# Altium schematic sheet Sheet1.SchDoc
size A4; SheetNumber: 1; SheetTotal: 1
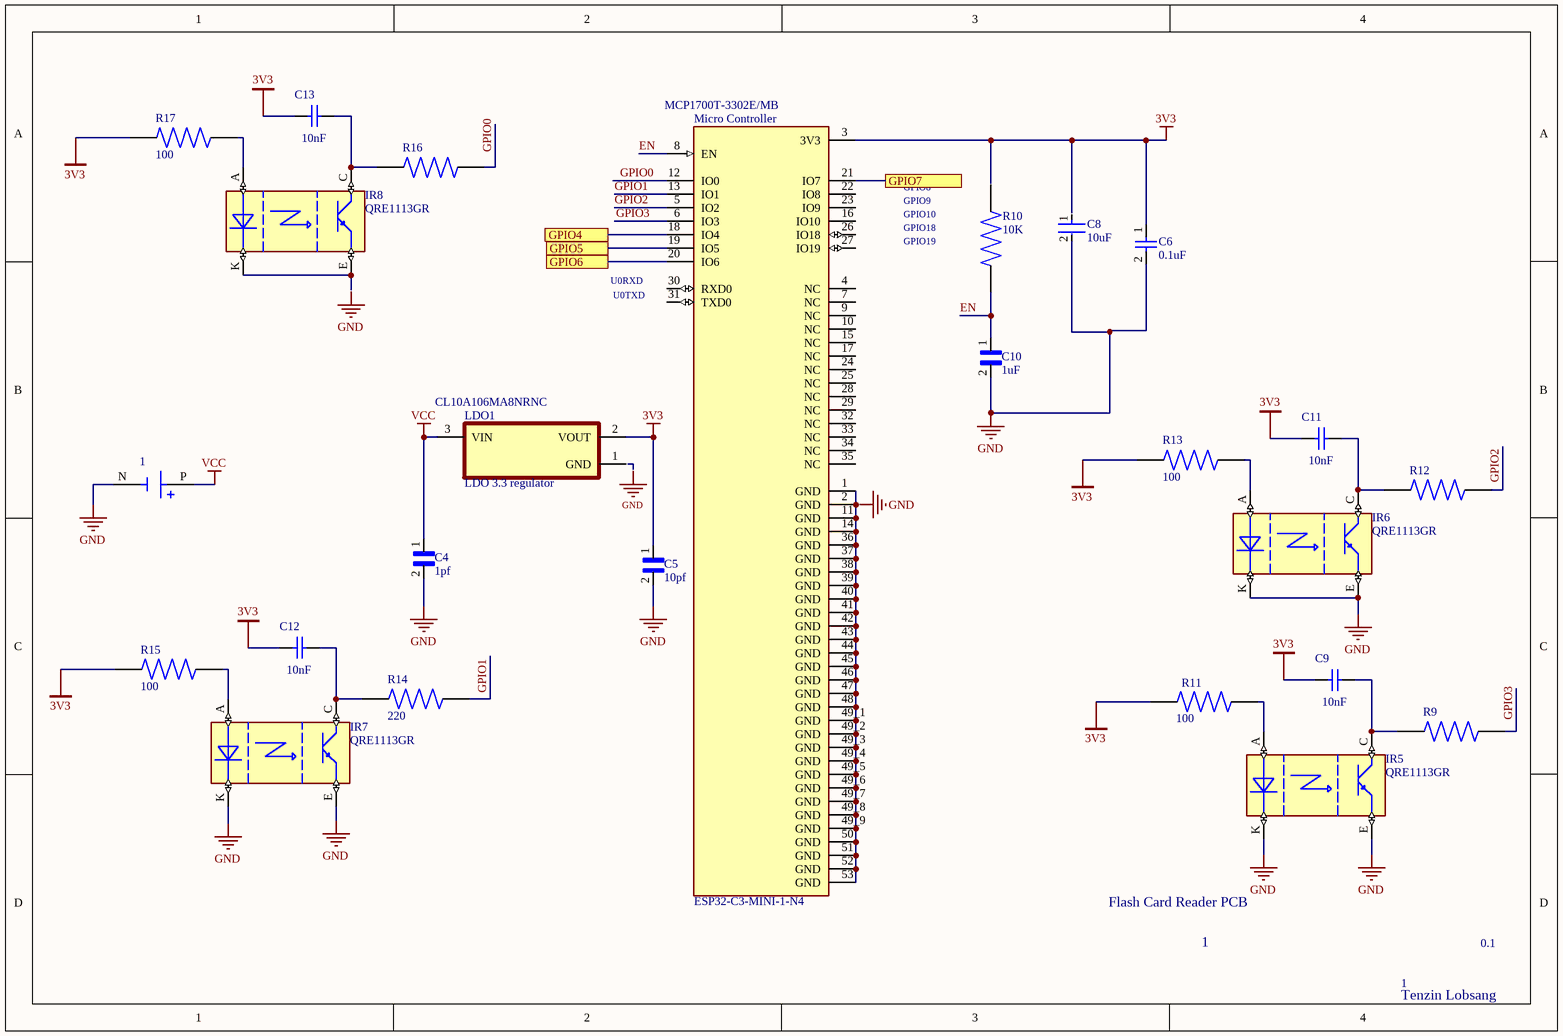
[diagram p0: Sheet1.SchDoc]

## Parts
1  (no value)  [BAT_1043]
C4  1pf  [CAPC2012X88N]
C5  10pf  [CAPC2012X88N]
C6  0.1uF  [CAPC1608X90X35NL10T15]
C8  10uF  [CAPC2012X88N]
C9  10nF  [WCAP-CSGP_0805_L2W1.25H1.25]
C10  1uF  [CAPC1608X90N]
C11  10nF  [WCAP-CSGP_0805_L2W1.25H1.25]
C12  10nF  [WCAP-CSGP_0805_L2W1.25H1.25]
C13  10nF  [WCAP-CSGP_0805_L2W1.25H1.25]
IR5  QRE1113GR  [4LEADSMD]
IR6  QRE1113GR  [4LEADSMD]
IR7  QRE1113GR  [4LEADSMD]
IR8  QRE1113GR  [4LEADSMD]
LDO1  LDO 3.3 regulator  Supplier Part Number 1: CL10A106MA8NRNC  [SOT95P237X112-3N]
Micro_Controller  ESP32-C3-MINI-1-N4  Supplier Part Number 1: MCP1700T-3302E/MB  [XCVR_ESP32-C3-MINI-1-N4]
R9  220  [RESC1005X35N]  (value not drawn)
R10  10K  [RESC1005X40N]
R11  100  [RESC6432X75N]
R12  220  [RESC1005X35N]  (value not drawn)
R13  100  [RESC6432X75N]
R14  220  [RESC1005X35N]
R15  100  [RESC6432X75N]
R16  220  [RESC1005X35N]  (value not drawn)
R17  100  [RESC6432X75N]

## Ports
GPIO4, GPIO5, GPIO6, GPIO7

## Nets
3V3: C5.1 C6.1 C9.1 C11.1 C12.1 C13.1 LDO1.2(VOUT) Micro_Controller.3(3V3) R11.1 R13.1 R15.1 R17.1
GND: 1.N(NEG) C4.2 C5.2 C6.2 C8.2 C10.2 IR5.E IR5.K IR6.E IR6.K IR7.E IR7.K
VCC: 1.P(POS) C4.1 LDO1.3(VIN)
EN: C10.1 Micro_Controller.8(EN) R10.1
GPIO0: Micro_Controller.12(IO0) R16.2
GPIO1: Micro_Controller.13(IO1) R14.2
GPIO2: Micro_Controller.5(IO2) R12.2
GPIO3: Micro_Controller.6(IO3) R9.2
GPIO4: Micro_Controller.18(IO4) ; port GPIO4
GPIO5: Micro_Controller.19(IO5) ; port GPIO5
GPIO6: Micro_Controller.20(IO6) ; port GPIO6
GPIO7: Micro_Controller.21(IO7) ; port GPIO7
NetC9_2: C9.2 IR5.C R9.1
NetC11_2: C11.2 IR6.C R12.1
NetC12_2: C12.2 IR7.C R14.1
NetC13_2: C13.2 IR8.C R16.1
NetIR5_A: IR5.A R11.2
NetIR6_A: IR6.A R13.2
NetIR7_A: IR7.A R15.2
NetIR8_A: IR8.A R17.2
NetIR8_E: IR8.E IR8.K
NetMicro_Controller_1: Micro_Controller.1(GND) Micro_Controller.2(GND) Micro_Controller.11(GND) Micro_Controller.14(GND) Micro_Controller.36(GND) Micro_Controller.37(GND) Micro_Controller.38(GND) Micro_Controller.39(GND) Micro_Controller.40(GND) Micro_Controller.41(GND) Micro_Controller.42(GND) Micro_Controller.43(GND) Micro_Controller.44(GND) Micro_Controller.45(GND) Micro_Controller.46(GND) Micro_Controller.47(GND) Micro_Controller.48(GND) Micro_Controller.49_1(GND) Micro_Controller.49_2(GND) Micro_Controller.49_3(GND) Micro_Controller.49_4(GND) Micro_Controller.49_5(GND) Micro_Controller.49_6(GND) Micro_Controller.49_7(GND) Micro_Controller.49_8(GND) Micro_Controller.49_9(GND) Micro_Controller.50(GND) Micro_Controller.51(GND) Micro_Controller.52(GND) Micro_Controller.53(GND)

Not connected (* = marked no-connect by the designer): C8 1; LDO1 1(GND); Micro_Controller 4(NC) 7(NC) 9(NC) 10(NC) 15(NC) 16(IO10) 17(NC) 22(IO8) 23(IO9) 24(NC) 25(NC) 26(IO18) 27(IO19) 28(NC) 29(NC) 30(RXD0) 31(TXD0) 32(NC) 33(NC) 34(NC) 35(NC); R10 2

## Notes on the sheet
- GPIO18
- GPIO19
- GPIO8
- GPIO9
- GPIO10
- U0RXD
- U0TXD
- Flash Card Reader PCB
- 1
- 0.1
- Tenzin Lobsang
- Labels drawn without touching a wire or pin: GND

## Library data of the parts
1 = 1043: Price: None; Availability: Unavailable; Value: *; MP: 1043; Package: None
C4 C5 = C0805C100K5RAC7800: Package: None; Price: None; Value: *; MP: C0805C100K5RAC7800; Availability: Unavailable
C6 = CMP-2100-03643-1: Chip Capacitor, 0.1 uF, +/- 10%, 50 V, -55 to 125 degC, 0603 (1608 Metric), RoHS, Tape and Reel; Manufacturer: Murata; Dielectric Material: Ceramic; Voltage Rating: 50V; Capacitance: 100nF; Dielectric: X7R; Insulation Resistance: 10GR; Case Code (Metric): 1608; Lead Free: LeadFree; Depth: 0.8mm; Number of Pins: 2; Radiation Hardening: No; Case/Package: 0603; Manufacturer URL: http://www.murata.com/; Packaging: TapeandReel; Length: 1.6mm; Contact Plating: Tin; Datasheet URL: http://psearch.en.murata.com/capacitor/product/GRM188R71H104KA93%23.pdf; Tolerance: 10%; Case Code (Imperial): 0603; Min Operating Temperature: -55degC; RoHSCompliant: true; Voltage: 50V; Termination: SMD/SMT; Mount: SurfaceMount; Material: Ceramic; Package Quantity: 1; Height: 0.8mm; Thickness: 0.035inch; REACH SVHC: NoSVHC; Max Operating Temperature: 125degC; Width: 0.8mm; Package Reference: 0603; Voltage Rating (DC): 50V; Datasheet Version: 42675.0; Package Description: 2-Pin Surface Mount Device, Body 1.6 x 0.8 mm
C8 = CMP-13271-004224-1: Cap Ceramic 10uF 25V X5R ±20% Pad SMD 0603 +85°C T/R; Width: 0.031inch; Voltage Rating: 25V; Length: 0.063inch; Case Code (Metric): 1608; Dielectric: X5R; Termination: Wraparound; Capacitance: 10uF; Lead Free: Lead Free; Mount: Surface Mount; Package Quantity: 1; Case Code (Imperial): 0603; Thickness: 0.035inch; Packaging: Tape and Reel; Contact Plating: Tin; Min Operating Temperature: -55°C; Tolerance: 20%; Max Operating Temperature: 85°C; Case/Package: 0603
C9 C11-C13 = 885012007009: WCAP-CSGP Multilayer Ceramic Chip Capacitor, General Purpose, size 0805, NP0, 10nF, 10V; Manufacturer: Wurth Elektronik; Case/Size Code: 0805; Capacitance Tolerance: +/-5%; Insulation Resistance: 10GΩ; Q Factor: 1000; Technical Reference: NP00805103J010DFCT10000; Manufacturer Part Number: 885012007009; Category: Multilayer Ceramic Chip Capacitors; Match Code: WCAP-CSGP; ComponentLink1Description: Website Link; ComponentLink1URL: https://www.we-online.com/redexpert/article/885012007009?ad; ComponentLink2Description: Datasheet Link; ComponentLink2URL: https://www.we-online.com/redexpert/spec/885012007009?ad; Mount: Surface Mount; Min Operating Temperature: -55°C; Max Operating Temperature: 125°C; Packaging: Tape and Reel; Length: 2mm; Width: 1.25mm; Height: 1.25mm; Capacitance: 10nF; Ceramic Type: NP0; Rated Voltage (DC): 10V
C10 = CL10B105KO8NNNC: 1ÂµF Â±10% 16V Ceramic Capacitor X7R 0603 (1608 Metric); MF: Samsung Electro-Mechanics; Digi-Key_Part_Number: 1276-1019-1-ND; Arrow_Electronics-Purchase-URL: https://snapeda.com/shop?store=Arrow+Electronics&id=3597999; Package: 0603 Samsung; DigiKey-Purchase-URL: https://snapeda.com/shop?store=DigiKey&id=3597999; SnapEDA_Link: https://www.snapeda.com/parts/CL10B105KO8NNNC/Samsung%20Electro-Mechanics/view-part/3597999/?ref=snap; MP: CL10B105KO8NNNC; Value: *; BuyPart: https://www.snapeda.com/parts/CL10B105KO8NNNC/Samsung%20Electro-Mechanics/view-part/3597999/?ref=eda
IR5-IR8 = QRE1113GR: Optical Switches, Reflective, Phototransistor Output Reflective Sensor; MF: SparkFun; SnapEDA_Link: https://www.snapeda.com/parts/QRE1113/SparkFun/view-part/?ref=snap; Package: None; Value: *; MP: QRE1113; Check_prices: https://www.snapeda.com/parts/QRE1113/SparkFun/view-part/?ref=eda
LDO1 = MCP1700T-3002E/TT: 25V 10uF X5R ±20% 0603 Multilayer Ceramic Capacitors MLCC - SMD/SMT ROHS; Manufacturer: Samsung; MF: Microchip; SnapEDA_Link: https://www.snapeda.com/parts/MCP1700T-3002E/TT/Microchip/view-part/48518/?ref=snap; MP: MCP1700T-3002E/TT; Availability: Unavailable; Price: None; Value: *; Package: SOT-23 Microchip; Supplier 1: Avnet; Manufacturer Part Number: CL10A106MA8NRNC; RoHS: Yes; Category: Ceramic Capacitors; Stock 1: 9192000; Pricing 1: 4000=0.01575 (USD); Mount: Surface Mount; Case/Package: 0603; Case Code (Metric): 1608; Case Code (Imperial): 0603; Material: Ceramic; Min Operating Temperature: -55°C; Max Operating Temperature: 85°C; Packaging: Cut Tape; Capacitance: 10uF; Tolerance: 20%; Voltage Rating: 25V; Series: CL; Height: 900um; Lead Free: Lead Free; RoHS Compliant: Yes; ComponentLink1URL: https://datasheet.ciiva.com/25766/cl10a106ma8nrnc-25766562.pdf?src-supplier=Digikey; ComponentLink1Description: https://datasheet.ciiva.com/25766/cl10a106ma8nrnc-25766562.pdf?src-supplier=Digikey
Micro_Controller = ESP32-C3-MINI-1-N4: Pwr Sply Func, Voltage Regulator, LDO, SOT-89, PD 1.635W, VO 3.3V, Regline +/-0.75%/V; Manufacturer: Microchip; MF: Espressif Systems; Number of Outputs: 1; Min Input Voltage: 2.3V; Max Output Current: 250mA; Dropout Voltage: 178mV; Max Input Voltage: 6V; Input Bias Current: 1.6uA; Polarity: Positive; Quiescent Current: 4uA; Accuracy: 3%; Output Type: Fixed; Output Voltage Accuracy: 2%; SnapEDA_Link: https://www.snapeda.com/parts/ESP32-C3-MINI-1-N4/Espressif+Systems/view-part/?ref=snap; Package: SMD-53 Espressif Systems; Value: *; MP: ESP32-C3-MINI-1-N4; Check_prices: https://www.snapeda.com/parts/ESP32-C3-MINI-1-N4/Espressif+Systems/view-part/?ref=eda; Supplier 1: Arrow Electronics; Manufacturer Part Number: MCP1700T-3302E/MB; RoHS: Yes; Category: Voltage Regulators - Linear; Stock 1: 650; Pricing 1: 1=0.4806, 10=0.4731, 25=0.4655, 100=0.458, 250=0.4505, 500=0.4429 (USD); Mount: Surface Mount; Case/Package: SOT-89; Number of Pins: 3; Min Operating Temperature: -40°C; Max Operating Temperature: 125°C; Packaging: Tape and Reel; Output Voltage: 3.3V; Output Current: 250mA; Nominal Output Voltage: 3.3V; Package Quantity: 1000; Max Power Dissipation: 1.635W; Min Output Voltage: 3.3V; Power Dissipation: 1.635W; Max Supply Voltage: 6V; Min Supply Voltage: 2.3V; Max Output Voltage: 3.3V; Termination: SMD/SMT; Supply Current: 4uA; Number of Channels: 1; Length: 4.6mm; Width: 2.29mm; Height: 1.6mm; Radiation Hardening: No; Reach SVHC Compliant: No; Lead Free: Lead Free; RoHS Compliant: Yes
R9 R12 R14 R16 = CPF0402B220RE1: Resistencia de pelÃ­cula delgada de precisiÃ³n SMD, carcasa 0402, 220 ohmios +/-0,1 %, 063 W +/-25 ppm/C ¦ TE Connectivity CPF0402B220RE1; Power_Rating: .063 W; Voltage_Rating: 25 V; Tolerance: .1%; SnapEDA_Link: https://www.snapeda.com/parts/CPF0402B220RE1/TE+Connectivity/view-part/?ref=snap; Package: 0402; Resistance: 220; Value: *; MF: TE Connectivity; MP: CPF0402B220RE1; EU_RoHS_Compliance: Compliant; Check_prices: https://www.snapeda.com/parts/CPF0402B220RE1/TE+Connectivity/view-part/?ref=eda
R10 = CRG0402J10K/10: CRG0402 chip resistor,10K 5% 0.063W | TE Connectivity CRG0402J10K/10; Power_Rating: .063 W; Voltage_Rating: 50 V; SnapEDA_Link: https://www.snapeda.com/parts/CRG0402J10K/10/TE+Connectivity+Passive+Product/view-part/?ref=snap; Package: 0402; Resistance: 10K; Value: *; MF: TE Connectivity; MP: CRG0402J10K/10; EU_RoHS_Compliance: Compliant with Exemptions; Tolerance: 5%; Check_prices: https://www.snapeda.com/parts/CRG0402J10K/10/TE+Connectivity+Passive+Product/view-part/?ref=eda
R11 R13 R15 R17 = CRS2512-FX-1000ELF: CRS Series Anti-surge Resistor 2512 Case 100Ohms 2W +/-100ppm/degC | Bourns CRS2512-FX-1000ELF; SnapEDA_Link: https://www.snapeda.com/parts/CRS2512-FX-1000ELF/Bourns/view-part/?ref=snap; Package: 6432 Bourns; Value: *; MF: Bourns; MP: CRS2512-FX-1000ELF; Check_prices: https://www.snapeda.com/parts/CRS2512-FX-1000ELF/Bourns/view-part/?ref=eda